# Altium schematic sheet Keyboard_on_board.SchDoc
size A4
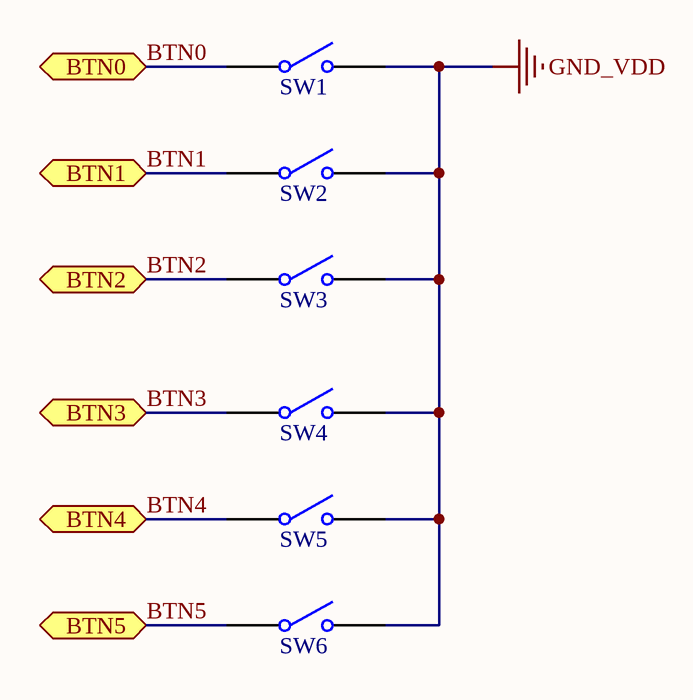
[diagram p0: Keyboard_on_board.SchDoc]

## Parts
SW1  "OK"  [KAN1211]  (value not drawn)
SW2  "Right"  [KAN1211]  (value not drawn)
SW3  "Down"  [KAN1211]  (value not drawn)
SW4  "Up"  [KAN1211]  (value not drawn)
SW5  "Left"  [KAN1211]  (value not drawn)
SW6  "Menu / Esc"  [KAN1211]  (value not drawn)

## Ports
BTN0 (bidir), BTN1 (bidir), BTN2 (bidir), BTN3 (bidir), BTN4 (bidir), BTN5 (bidir)

## Nets
GND_VDD: SW1.2(NO) SW2.2(NO) SW3.2(NO) SW4.2(NO) SW5.2(NO) SW6.2(NO)
BTN0: SW1.1(COMMON) ; port BTN0
BTN1: SW2.1(COMMON) ; port BTN1
BTN2: SW3.1(COMMON) ; port BTN2
BTN3: SW4.1(COMMON) ; port BTN3
BTN4: SW5.1(COMMON) ; port BTN4
BTN5: SW6.1(COMMON) ; port BTN5

## Library data of the parts
SW1-SW6 = TACT Switch: Single-Pole, Single-Throw Switch; Published: 24-Mar-1999; LatestRevisionDate: 17-Jul-2002; LatestRevisionNote: Re-released for DXP Platform.; PackageReference: SPST-2; Publisher: Altium Limited; PackageDescription: Switch; 2 Leads